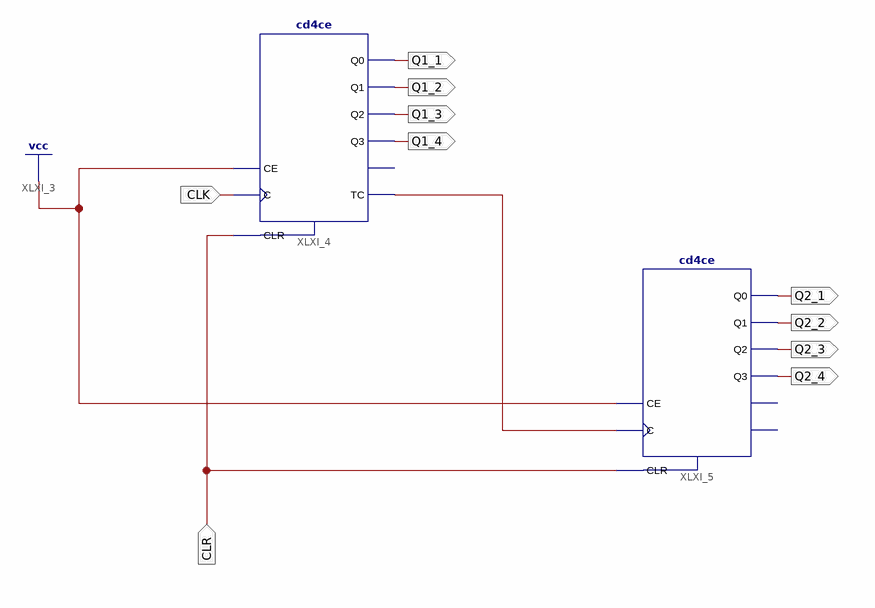
[diagram p0: schematic sheet 1]
// Xilinx ISE schematic counter.sch (spartan6) as structural Verilog: 2 symbols, 10 ports
module counter (
  input  CLR,
  input  CLK,
  output Q1_1,
  output Q1_2,
  output Q1_3,
  output Q1_4,
  output Q2_1,
  output Q2_2,
  output Q2_3,
  output Q2_4
);

  wire XLXN_4;

  cd4ce XLXI_4 (.C(CLK), .CE(1'b1), .CLR(CLR), .Q0(Q1_1), .Q1(Q1_2), .Q2(Q1_3), .Q3(Q1_4), .TC(XLXN_4));  // open: CEO
  cd4ce XLXI_5 (.C(XLXN_4), .CE(1'b1), .CLR(CLR), .Q0(Q2_1), .Q1(Q2_2), .Q2(Q2_3), .Q3(Q2_4));  // open: CEO, TC
endmodule
